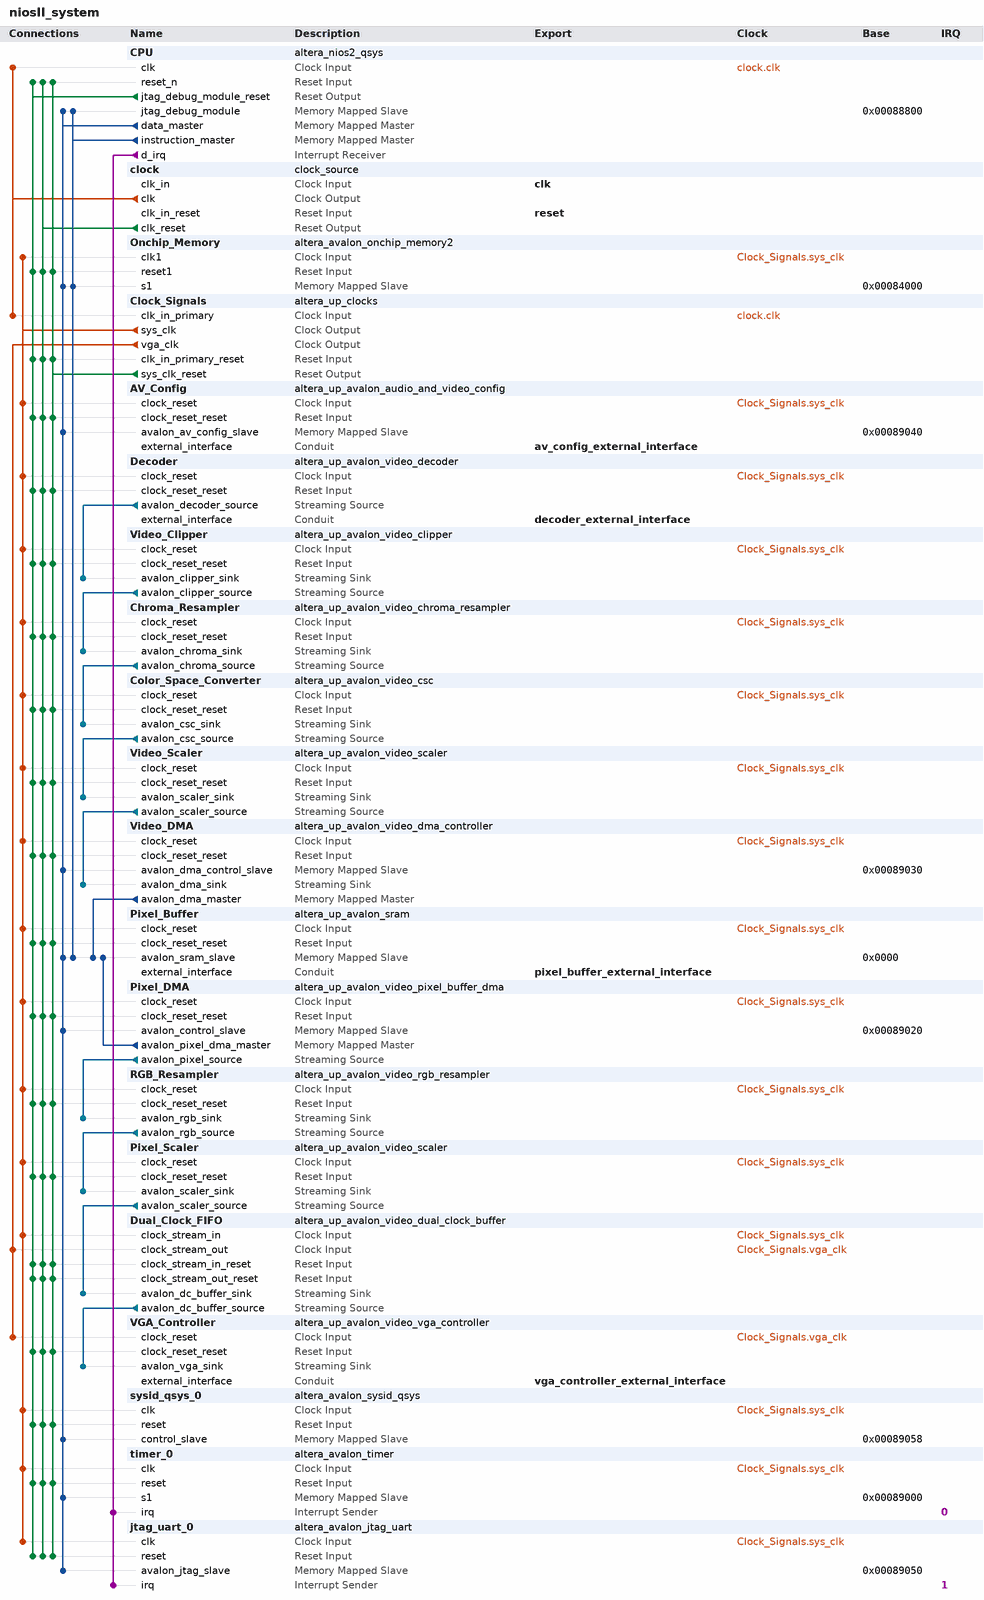
[diagram p0: system contents]
# Platform Designer (Qsys) system niosII_system, Cyclone II EP2C35F672C6
# Parameters at their usual value, and those the tool derives, are not listed.
package require -exact qsys 12.0
create_system niosII_system
set_project_property DEVICE_FAMILY {Cyclone II}
set_project_property DEVICE EP2C35F672C6

add_instance CPU altera_nios2_qsys 12.1
set_instance_parameter_value CPU manuallyAssignCpuID false
set_instance_parameter_value CPU resetSlave Onchip_Memory.s1
set_instance_parameter_value CPU exceptionSlave Onchip_Memory.s1
set_instance_parameter_value CPU breakSlave CPU.jtag_debug_module
set_instance_parameter_value CPU impl Tiny
set_instance_parameter_value CPU icache_size 4096

add_instance clock clock_source 12.1
set_instance_parameter_value clock clockFrequency 50000000

add_instance Onchip_Memory altera_avalon_onchip_memory2 12.1
set_instance_parameter_value Onchip_Memory dataWidth 32
set_instance_parameter_value Onchip_Memory dualPort false
set_instance_parameter_value Onchip_Memory initMemContent true
set_instance_parameter_value Onchip_Memory initializationFileName Onchip_Memory
set_instance_parameter_value Onchip_Memory memorySize 16384

add_instance Clock_Signals altera_up_clocks 12.0
set_instance_parameter_value Clock_Signals board DE2
set_instance_parameter_value Clock_Signals sdram_clk false
set_instance_parameter_value Clock_Signals vga_clk true
set_instance_parameter_value Clock_Signals audio_clk false
set_instance_parameter_value Clock_Signals audio_clk_freq 12.288

add_instance AV_Config altera_up_avalon_audio_and_video_config 12.0
set_instance_parameter_value AV_Config board DE2
set_instance_parameter_value AV_Config audio_in {Microphone to ADC}
set_instance_parameter_value AV_Config line_in_bypass false
set_instance_parameter_value AV_Config bit_length 24
set_instance_parameter_value AV_Config sampling_rate {48 kHz}

add_instance Decoder altera_up_avalon_video_decoder 12.0

add_instance Video_Clipper altera_up_avalon_video_clipper 12.0
set_instance_parameter_value Video_Clipper color_bits 8
set_instance_parameter_value Video_Clipper color_planes 2

add_instance Chroma_Resampler altera_up_avalon_video_chroma_resampler 12.0

add_instance Color_Space_Converter altera_up_avalon_video_csc 12.0

add_instance Video_Scaler altera_up_avalon_video_scaler 12.0
set_instance_parameter_value Video_Scaler width_scaling 0.5
set_instance_parameter_value Video_Scaler height_scaling 1
set_instance_parameter_value Video_Scaler width_in 640
set_instance_parameter_value Video_Scaler color_bits 8
set_instance_parameter_value Video_Scaler color_planes 3

add_instance Video_DMA altera_up_avalon_video_dma_controller 12.0
set_instance_parameter_value Video_DMA mode {From Stream to Memory}
set_instance_parameter_value Video_DMA addr_mode X-Y
set_instance_parameter_value Video_DMA start_address 0
set_instance_parameter_value Video_DMA back_start_address 0
set_instance_parameter_value Video_DMA width 320
set_instance_parameter_value Video_DMA height 240
set_instance_parameter_value Video_DMA color_bits 8
set_instance_parameter_value Video_DMA color_planes 3

add_instance Pixel_Buffer altera_up_avalon_sram 12.0
set_instance_parameter_value Pixel_Buffer board DE2
set_instance_parameter_value Pixel_Buffer pixel_buffer true

add_instance Pixel_DMA altera_up_avalon_video_pixel_buffer_dma 12.0
set_instance_parameter_value Pixel_DMA addr_mode X-Y
set_instance_parameter_value Pixel_DMA start_address 0
set_instance_parameter_value Pixel_DMA back_start_address 0
set_instance_parameter_value Pixel_DMA image_width 320
set_instance_parameter_value Pixel_DMA image_height 240
set_instance_parameter_value Pixel_DMA color_space {24-bit RGB}

add_instance RGB_Resampler altera_up_avalon_video_rgb_resampler 12.0
set_instance_parameter_value RGB_Resampler input_type {24-bit RGB}
set_instance_parameter_value RGB_Resampler output_type {30-bit RGB}
set_instance_parameter_value RGB_Resampler alpha 1023

add_instance Pixel_Scaler altera_up_avalon_video_scaler 12.0
set_instance_parameter_value Pixel_Scaler width_scaling 2
set_instance_parameter_value Pixel_Scaler height_scaling 2
set_instance_parameter_value Pixel_Scaler width_in 320
set_instance_parameter_value Pixel_Scaler color_bits 10
set_instance_parameter_value Pixel_Scaler color_planes 3

add_instance Dual_Clock_FIFO altera_up_avalon_video_dual_clock_buffer 12.0
set_instance_parameter_value Dual_Clock_FIFO color_bits 10

add_instance VGA_Controller altera_up_avalon_video_vga_controller 12.0
set_instance_parameter_value VGA_Controller board DE2

add_instance sysid_qsys_0 altera_avalon_sysid_qsys 12.1
set_instance_parameter_value sysid_qsys_0 id 0

add_instance timer_0 altera_avalon_timer 12.1
set_instance_parameter_value timer_0 period 1
set_instance_parameter_value timer_0 periodUnits MSEC
set_instance_parameter_value timer_0 timerPreset CUSTOM

add_instance jtag_uart_0 altera_avalon_jtag_uart 12.1
set_instance_parameter_value jtag_uart_0 simInteractiveOptions INTERACTIVE_ASCII_OUTPUT

# connections
add_connection clock.clk Clock_Signals.clk_in_primary clock
add_connection clock.clk CPU.clk clock
add_connection Clock_Signals.sys_clk AV_Config.clock_reset clock
add_connection Clock_Signals.sys_clk Chroma_Resampler.clock_reset clock
add_connection Clock_Signals.sys_clk Color_Space_Converter.clock_reset clock
add_connection Clock_Signals.sys_clk Decoder.clock_reset clock
add_connection Clock_Signals.sys_clk Dual_Clock_FIFO.clock_stream_in clock
add_connection Clock_Signals.sys_clk jtag_uart_0.clk clock
add_connection Clock_Signals.sys_clk Onchip_Memory.clk1 clock
add_connection Clock_Signals.sys_clk Pixel_Buffer.clock_reset clock
add_connection Clock_Signals.sys_clk Pixel_DMA.clock_reset clock
add_connection Clock_Signals.sys_clk Pixel_Scaler.clock_reset clock
add_connection Clock_Signals.sys_clk RGB_Resampler.clock_reset clock
add_connection Clock_Signals.sys_clk sysid_qsys_0.clk clock
add_connection Clock_Signals.sys_clk timer_0.clk clock
add_connection Clock_Signals.sys_clk Video_Clipper.clock_reset clock
add_connection Clock_Signals.sys_clk Video_DMA.clock_reset clock
add_connection Clock_Signals.sys_clk Video_Scaler.clock_reset clock
add_connection Clock_Signals.vga_clk Dual_Clock_FIFO.clock_stream_out clock
add_connection Clock_Signals.vga_clk VGA_Controller.clock_reset clock
add_connection clock.clk_reset AV_Config.clock_reset_reset reset
add_connection clock.clk_reset Chroma_Resampler.clock_reset_reset reset
add_connection clock.clk_reset Clock_Signals.clk_in_primary_reset reset
add_connection clock.clk_reset Color_Space_Converter.clock_reset_reset reset
add_connection clock.clk_reset CPU.reset_n reset
add_connection clock.clk_reset Decoder.clock_reset_reset reset
add_connection clock.clk_reset Dual_Clock_FIFO.clock_stream_in_reset reset
add_connection clock.clk_reset Dual_Clock_FIFO.clock_stream_out_reset reset
add_connection clock.clk_reset jtag_uart_0.reset reset
add_connection clock.clk_reset Onchip_Memory.reset1 reset
add_connection clock.clk_reset Pixel_Buffer.clock_reset_reset reset
add_connection clock.clk_reset Pixel_DMA.clock_reset_reset reset
add_connection clock.clk_reset Pixel_Scaler.clock_reset_reset reset
add_connection clock.clk_reset RGB_Resampler.clock_reset_reset reset
add_connection clock.clk_reset sysid_qsys_0.reset reset
add_connection clock.clk_reset timer_0.reset reset
add_connection clock.clk_reset VGA_Controller.clock_reset_reset reset
add_connection clock.clk_reset Video_Clipper.clock_reset_reset reset
add_connection clock.clk_reset Video_DMA.clock_reset_reset reset
add_connection clock.clk_reset Video_Scaler.clock_reset_reset reset
add_connection Clock_Signals.sys_clk_reset AV_Config.clock_reset_reset reset
add_connection Clock_Signals.sys_clk_reset Chroma_Resampler.clock_reset_reset reset
add_connection Clock_Signals.sys_clk_reset Clock_Signals.clk_in_primary_reset reset
add_connection Clock_Signals.sys_clk_reset Color_Space_Converter.clock_reset_reset reset
add_connection Clock_Signals.sys_clk_reset CPU.reset_n reset
add_connection Clock_Signals.sys_clk_reset Decoder.clock_reset_reset reset
add_connection Clock_Signals.sys_clk_reset Dual_Clock_FIFO.clock_stream_in_reset reset
add_connection Clock_Signals.sys_clk_reset Dual_Clock_FIFO.clock_stream_out_reset reset
add_connection Clock_Signals.sys_clk_reset jtag_uart_0.reset reset
add_connection Clock_Signals.sys_clk_reset Onchip_Memory.reset1 reset
add_connection Clock_Signals.sys_clk_reset Pixel_Buffer.clock_reset_reset reset
add_connection Clock_Signals.sys_clk_reset Pixel_DMA.clock_reset_reset reset
add_connection Clock_Signals.sys_clk_reset Pixel_Scaler.clock_reset_reset reset
add_connection Clock_Signals.sys_clk_reset RGB_Resampler.clock_reset_reset reset
add_connection Clock_Signals.sys_clk_reset sysid_qsys_0.reset reset
add_connection Clock_Signals.sys_clk_reset timer_0.reset reset
add_connection Clock_Signals.sys_clk_reset VGA_Controller.clock_reset_reset reset
add_connection Clock_Signals.sys_clk_reset Video_Clipper.clock_reset_reset reset
add_connection Clock_Signals.sys_clk_reset Video_DMA.clock_reset_reset reset
add_connection Clock_Signals.sys_clk_reset Video_Scaler.clock_reset_reset reset
add_connection CPU.jtag_debug_module_reset AV_Config.clock_reset_reset reset
add_connection CPU.jtag_debug_module_reset Chroma_Resampler.clock_reset_reset reset
add_connection CPU.jtag_debug_module_reset Clock_Signals.clk_in_primary_reset reset
add_connection CPU.jtag_debug_module_reset Color_Space_Converter.clock_reset_reset reset
add_connection CPU.jtag_debug_module_reset CPU.reset_n reset
add_connection CPU.jtag_debug_module_reset Decoder.clock_reset_reset reset
add_connection CPU.jtag_debug_module_reset Dual_Clock_FIFO.clock_stream_in_reset reset
add_connection CPU.jtag_debug_module_reset Dual_Clock_FIFO.clock_stream_out_reset reset
add_connection CPU.jtag_debug_module_reset jtag_uart_0.reset reset
add_connection CPU.jtag_debug_module_reset Onchip_Memory.reset1 reset
add_connection CPU.jtag_debug_module_reset Pixel_Buffer.clock_reset_reset reset
add_connection CPU.jtag_debug_module_reset Pixel_DMA.clock_reset_reset reset
add_connection CPU.jtag_debug_module_reset Pixel_Scaler.clock_reset_reset reset
add_connection CPU.jtag_debug_module_reset RGB_Resampler.clock_reset_reset reset
add_connection CPU.jtag_debug_module_reset sysid_qsys_0.reset reset
add_connection CPU.jtag_debug_module_reset timer_0.reset reset
add_connection CPU.jtag_debug_module_reset VGA_Controller.clock_reset_reset reset
add_connection CPU.jtag_debug_module_reset Video_Clipper.clock_reset_reset reset
add_connection CPU.jtag_debug_module_reset Video_DMA.clock_reset_reset reset
add_connection CPU.jtag_debug_module_reset Video_Scaler.clock_reset_reset reset
add_connection CPU.data_master AV_Config.avalon_av_config_slave avalon
set_connection_parameter_value CPU.data_master/AV_Config.avalon_av_config_slave baseAddress 0x00089040
add_connection CPU.data_master CPU.jtag_debug_module avalon
set_connection_parameter_value CPU.data_master/CPU.jtag_debug_module baseAddress 0x00088800
add_connection CPU.data_master jtag_uart_0.avalon_jtag_slave avalon
set_connection_parameter_value CPU.data_master/jtag_uart_0.avalon_jtag_slave baseAddress 0x00089050
add_connection CPU.data_master Onchip_Memory.s1 avalon
set_connection_parameter_value CPU.data_master/Onchip_Memory.s1 baseAddress 0x00084000
add_connection CPU.data_master Pixel_Buffer.avalon_sram_slave avalon
set_connection_parameter_value CPU.data_master/Pixel_Buffer.avalon_sram_slave baseAddress 0x0000
add_connection CPU.data_master Pixel_DMA.avalon_control_slave avalon
set_connection_parameter_value CPU.data_master/Pixel_DMA.avalon_control_slave baseAddress 0x00089020
add_connection CPU.data_master sysid_qsys_0.control_slave avalon
set_connection_parameter_value CPU.data_master/sysid_qsys_0.control_slave baseAddress 0x00089058
add_connection CPU.data_master timer_0.s1 avalon
set_connection_parameter_value CPU.data_master/timer_0.s1 baseAddress 0x00089000
add_connection CPU.data_master Video_DMA.avalon_dma_control_slave avalon
set_connection_parameter_value CPU.data_master/Video_DMA.avalon_dma_control_slave baseAddress 0x00089030
add_connection CPU.instruction_master CPU.jtag_debug_module avalon
set_connection_parameter_value CPU.instruction_master/CPU.jtag_debug_module baseAddress 0x00088800
add_connection CPU.instruction_master Onchip_Memory.s1 avalon
set_connection_parameter_value CPU.instruction_master/Onchip_Memory.s1 baseAddress 0x00084000
add_connection CPU.instruction_master Pixel_Buffer.avalon_sram_slave avalon
set_connection_parameter_value CPU.instruction_master/Pixel_Buffer.avalon_sram_slave baseAddress 0x0000
add_connection Pixel_DMA.avalon_pixel_dma_master Pixel_Buffer.avalon_sram_slave avalon
set_connection_parameter_value Pixel_DMA.avalon_pixel_dma_master/Pixel_Buffer.avalon_sram_slave baseAddress 0x0000
add_connection Video_DMA.avalon_dma_master Pixel_Buffer.avalon_sram_slave avalon
set_connection_parameter_value Video_DMA.avalon_dma_master/Pixel_Buffer.avalon_sram_slave baseAddress 0x0000
add_connection Chroma_Resampler.avalon_chroma_source Color_Space_Converter.avalon_csc_sink avalon_streaming
add_connection Color_Space_Converter.avalon_csc_source Video_Scaler.avalon_scaler_sink avalon_streaming
add_connection Decoder.avalon_decoder_source Video_Clipper.avalon_clipper_sink avalon_streaming
add_connection Dual_Clock_FIFO.avalon_dc_buffer_source VGA_Controller.avalon_vga_sink avalon_streaming
add_connection Pixel_DMA.avalon_pixel_source RGB_Resampler.avalon_rgb_sink avalon_streaming
add_connection Pixel_Scaler.avalon_scaler_source Dual_Clock_FIFO.avalon_dc_buffer_sink avalon_streaming
add_connection RGB_Resampler.avalon_rgb_source Pixel_Scaler.avalon_scaler_sink avalon_streaming
add_connection Video_Clipper.avalon_clipper_source Chroma_Resampler.avalon_chroma_sink avalon_streaming
add_connection Video_Scaler.avalon_scaler_source Video_DMA.avalon_dma_sink avalon_streaming
add_connection CPU.d_irq jtag_uart_0.irq interrupt
set_connection_parameter_value CPU.d_irq/jtag_uart_0.irq irqNumber 1
add_connection CPU.d_irq timer_0.irq interrupt
set_connection_parameter_value CPU.d_irq/timer_0.irq irqNumber 0

# exported interfaces
add_interface clk clock sink
set_interface_property clk EXPORT_OF clock.clk_in
add_interface reset reset sink
set_interface_property reset EXPORT_OF clock.clk_in_reset
add_interface pixel_buffer_external_interface conduit end
set_interface_property pixel_buffer_external_interface EXPORT_OF Pixel_Buffer.external_interface
add_interface av_config_external_interface conduit end
set_interface_property av_config_external_interface EXPORT_OF AV_Config.external_interface
add_interface decoder_external_interface conduit end
set_interface_property decoder_external_interface EXPORT_OF Decoder.external_interface
add_interface vga_controller_external_interface conduit end
set_interface_property vga_controller_external_interface EXPORT_OF VGA_Controller.external_interface

save_system niosII_system.qsys
